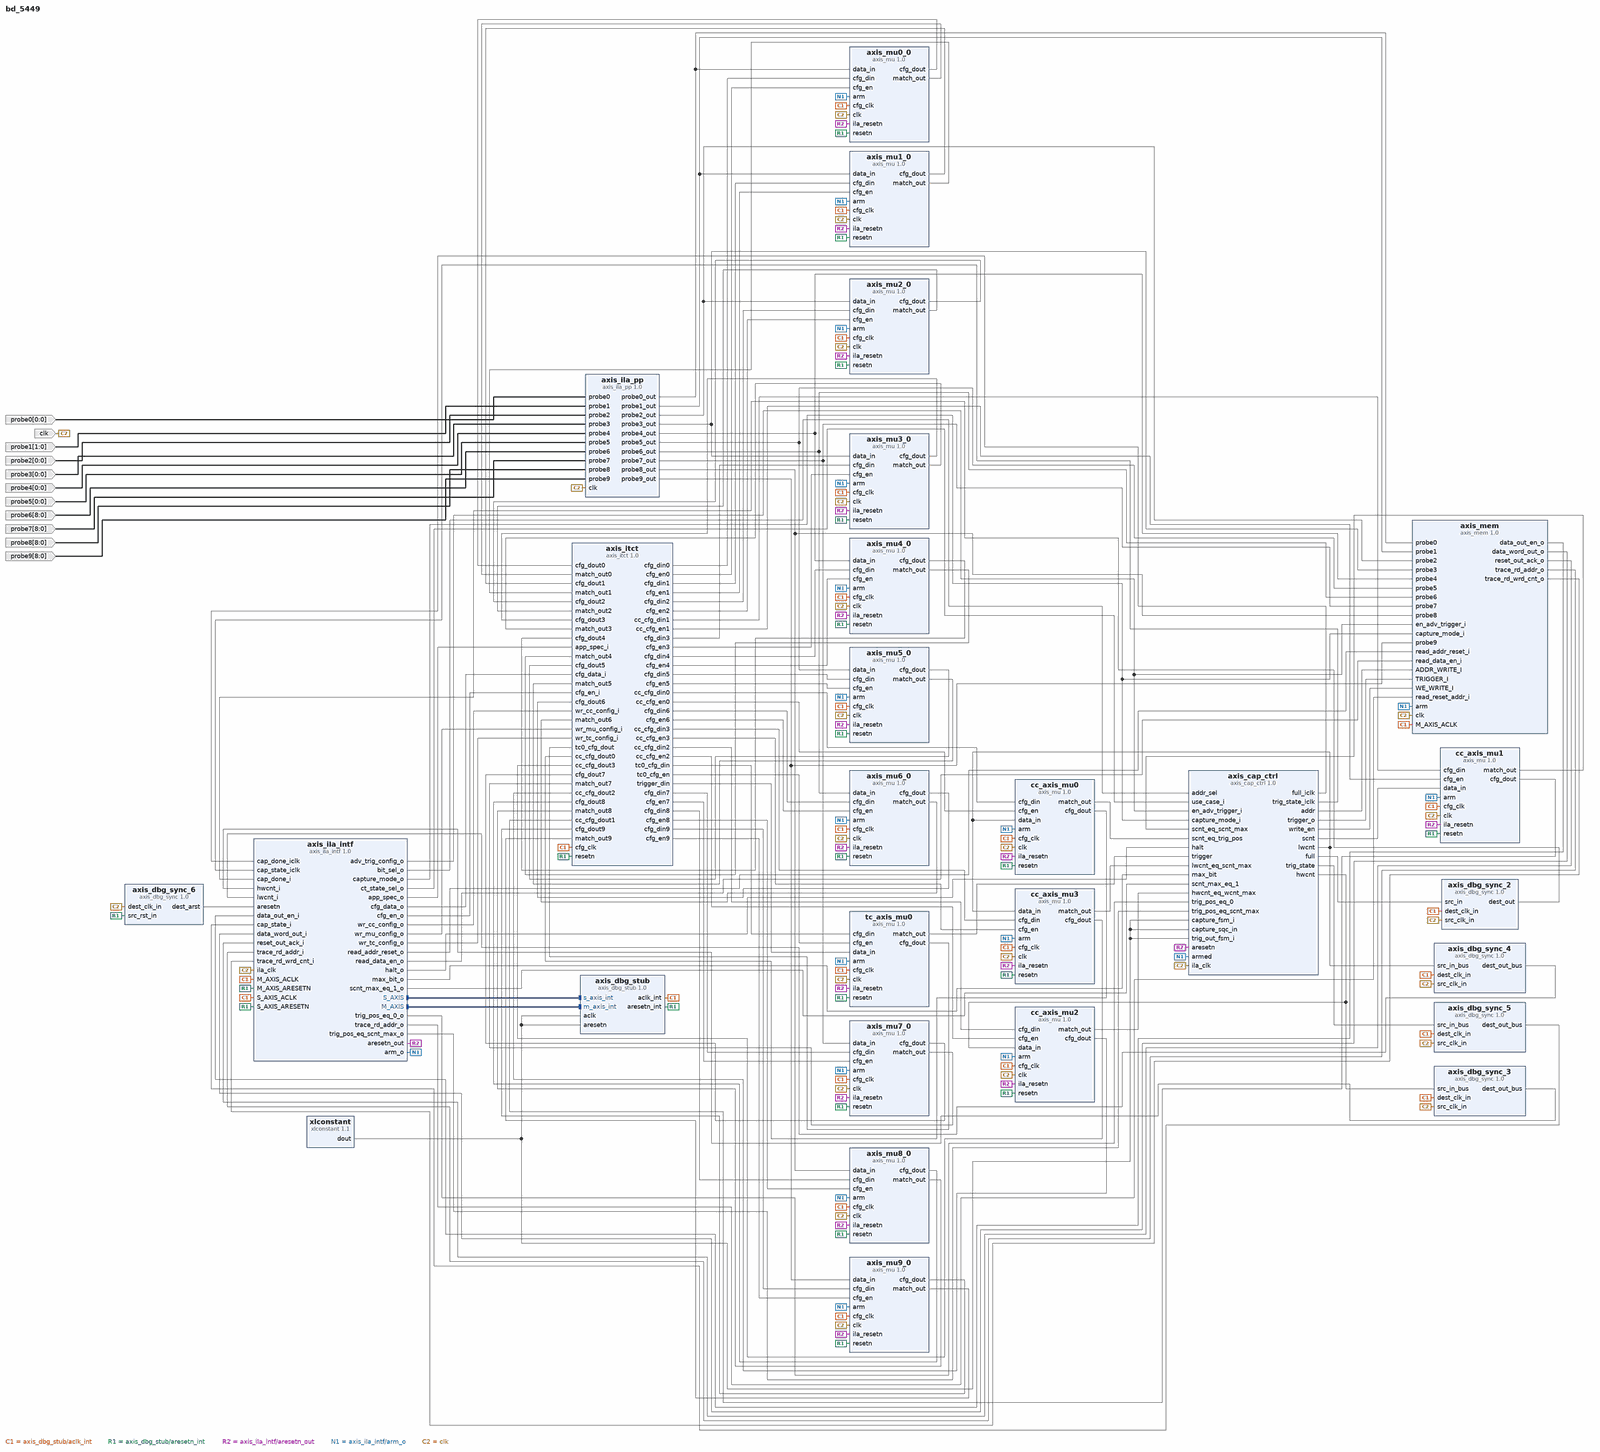
[diagram p0: block diagram of the top level, whole]
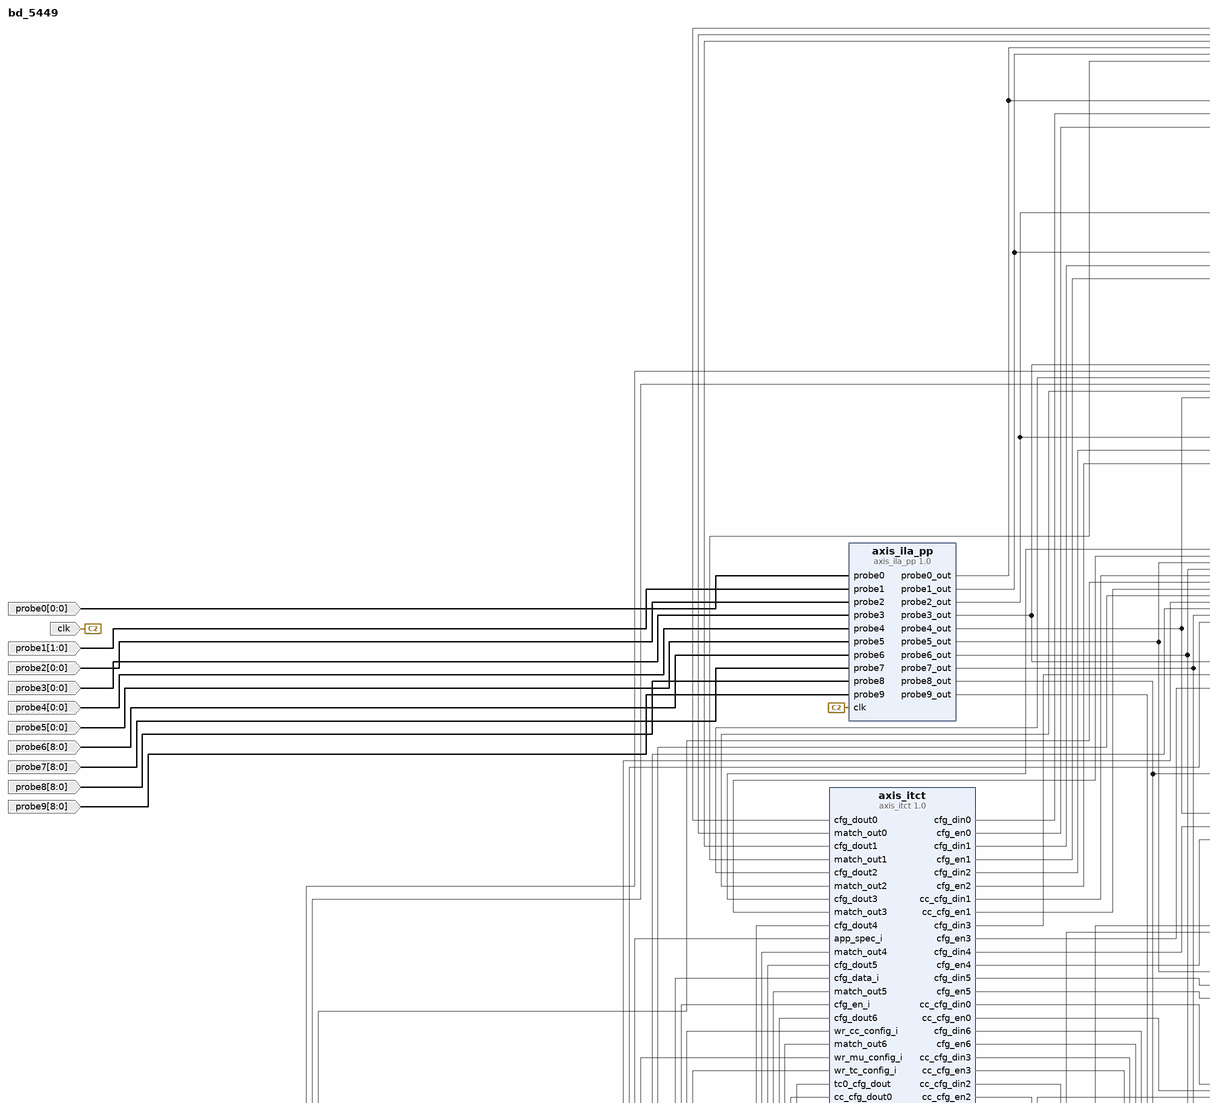
[diagram p1: block diagram of the top level, upper left part]
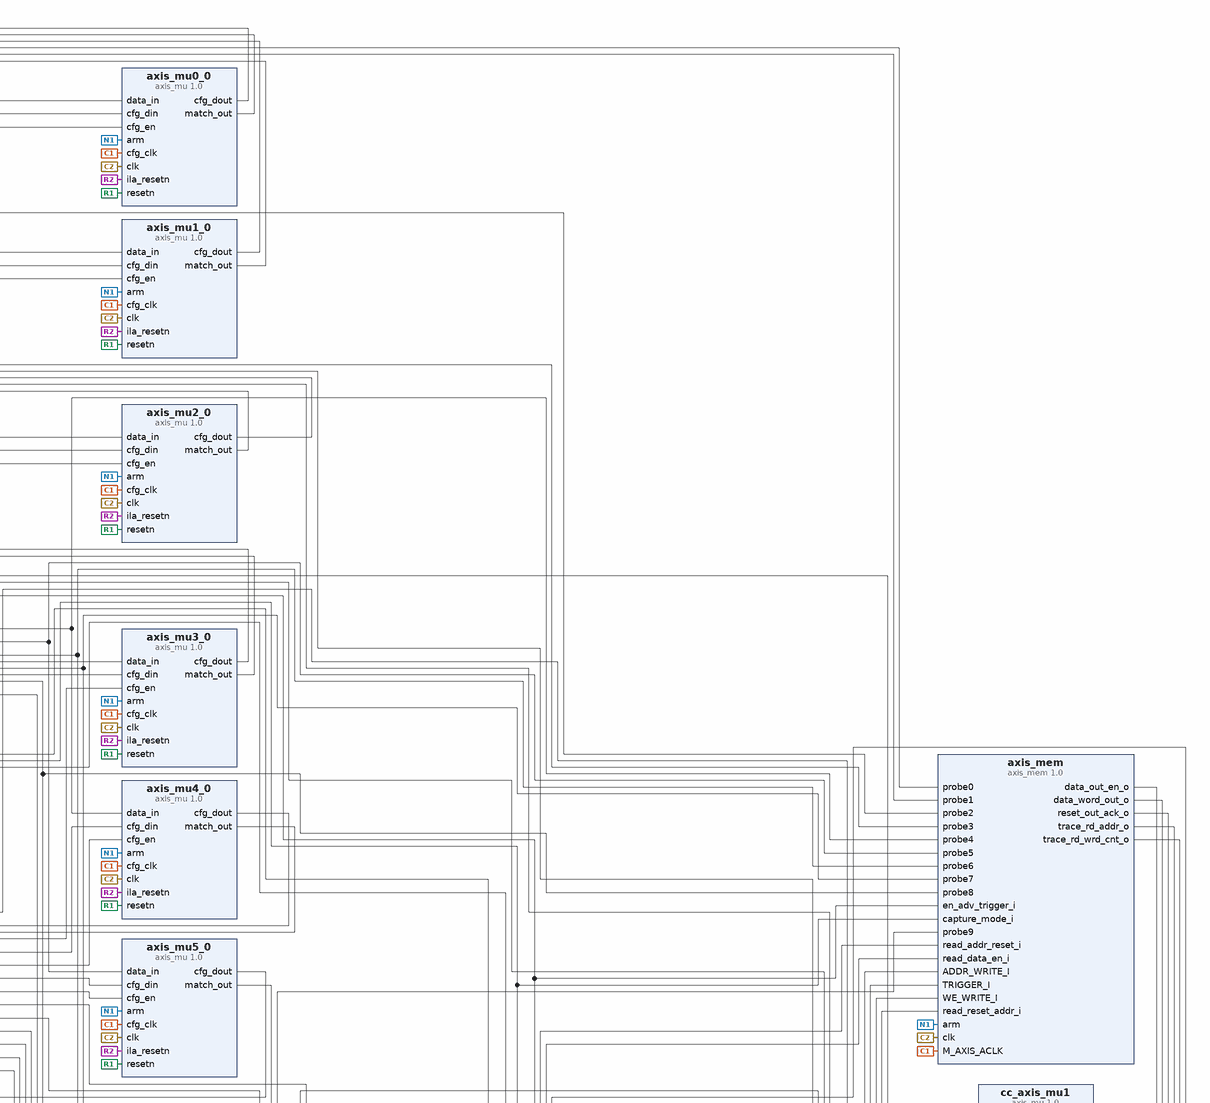
[diagram p2: block diagram of the top level, upper right part]
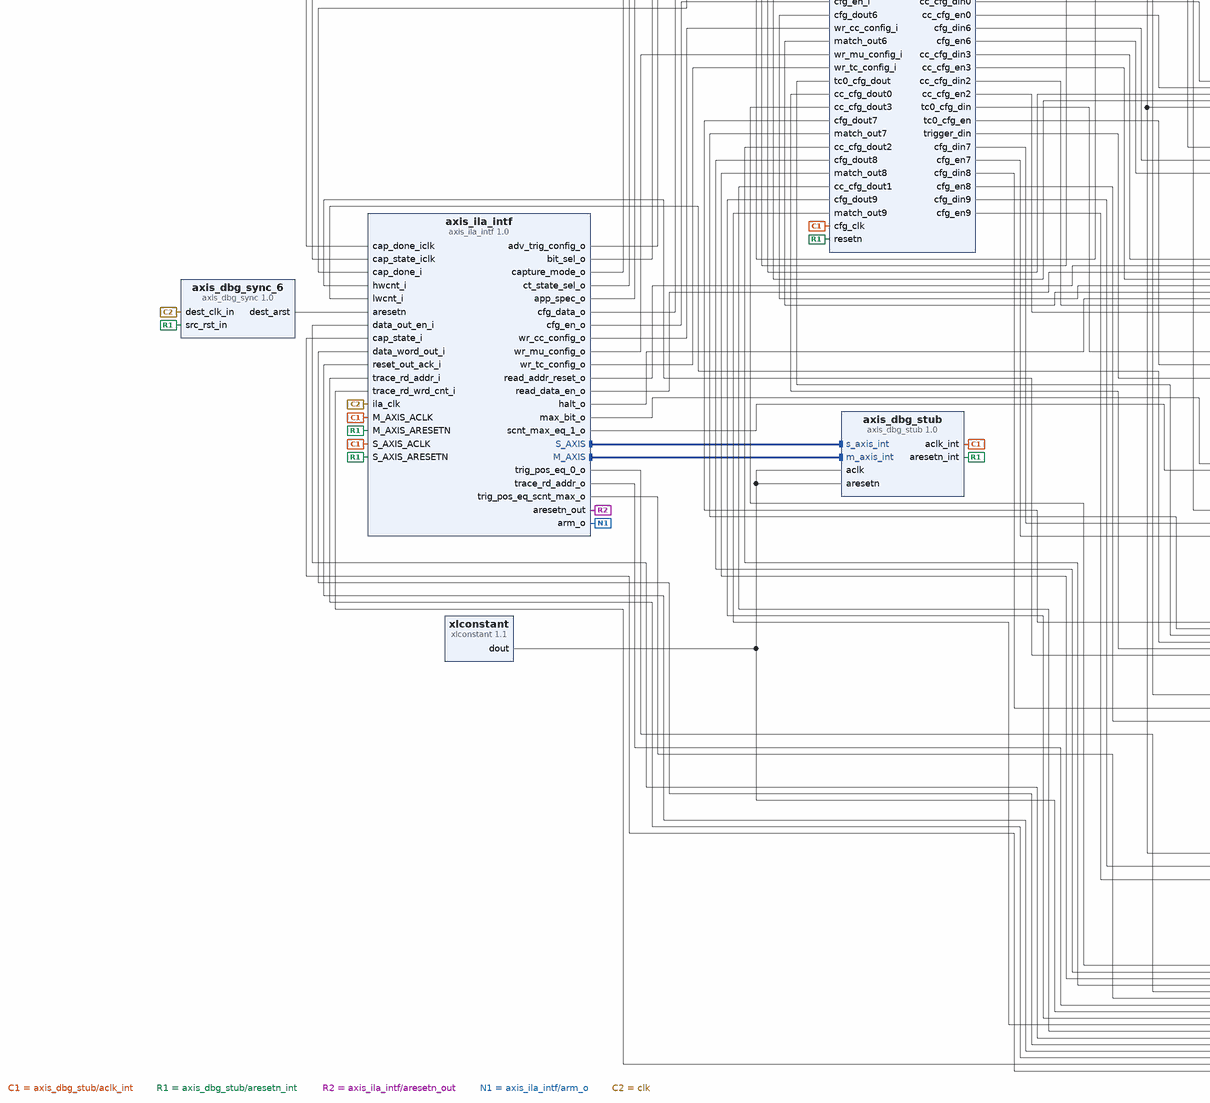
[diagram p3: block diagram of the top level, lower left part]
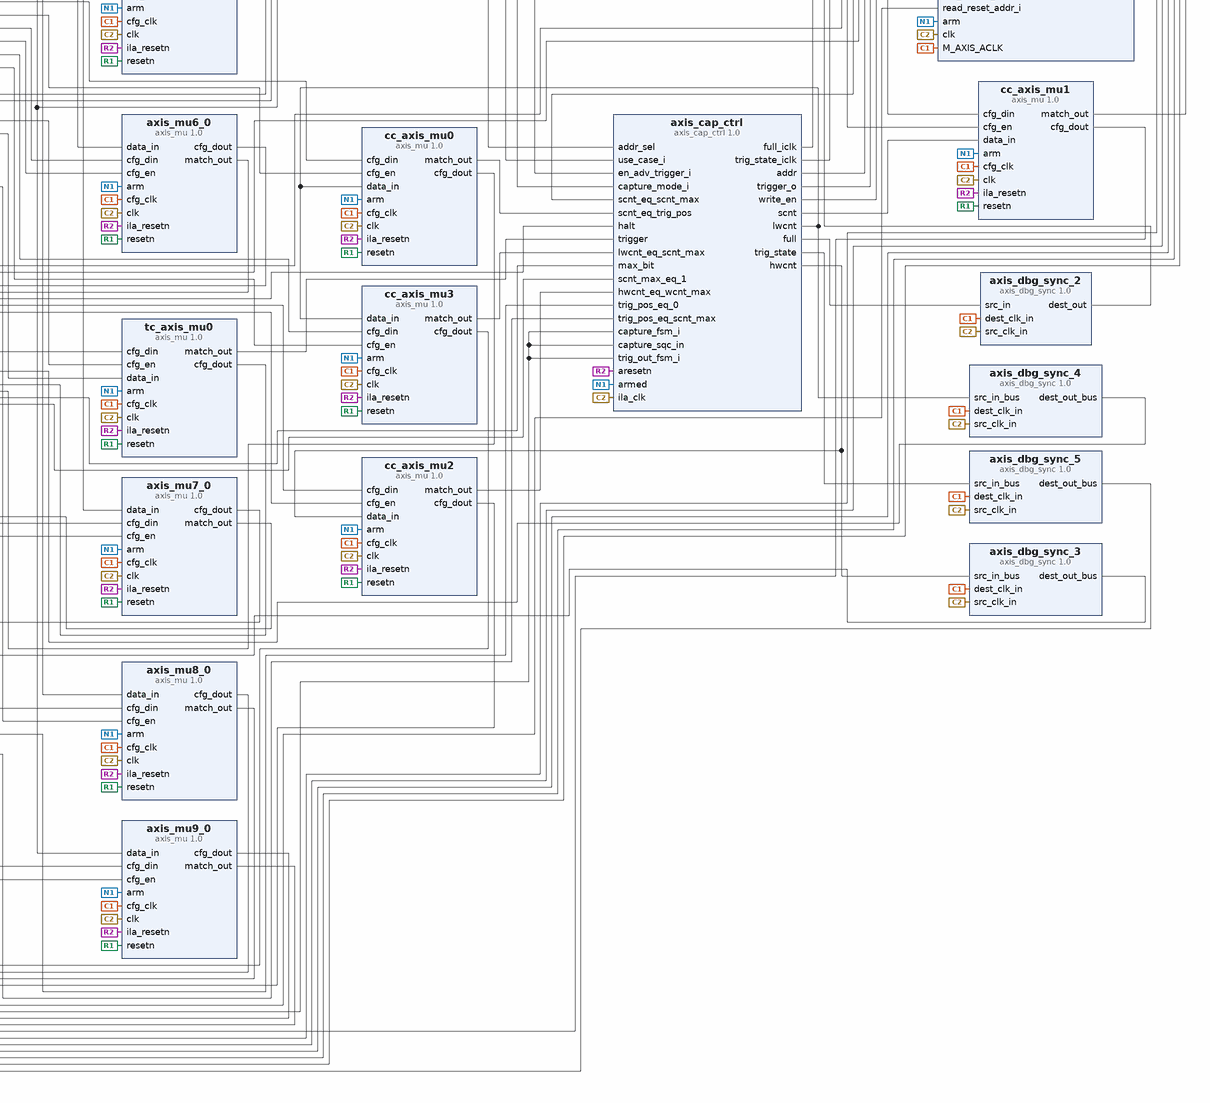
[diagram p4: block diagram of the top level, lower right part]
# Vivado block design bd_5449, xcvp1202-vsva2785-2MP-e-S, Vivado 2024.2
create_bd_design bd_5449

create_bd_port -dir I -type clk clk
create_bd_port -dir I -from 0 -to 0 -type data probe0
create_bd_port -dir I -from 1 -to 0 -type data probe1
create_bd_port -dir I -from 0 -to 0 -type data probe2
create_bd_port -dir I -from 0 -to 0 -type data probe3
create_bd_port -dir I -from 0 -to 0 -type data probe4
create_bd_port -dir I -from 0 -to 0 -type data probe5
create_bd_port -dir I -from 8 -to 0 -type data probe6
create_bd_port -dir I -from 8 -to 0 -type data probe7
create_bd_port -dir I -from 8 -to 0 -type data probe8
create_bd_port -dir I -from 8 -to 0 -type data probe9

create_bd_cell -type ip -vlnv xilinx.com:ip:axis_dbg_stub:1.0 axis_dbg_stub
set_property -dict {CONFIG.C_AXIS_DATA_WIDTH 32} [get_bd_cells axis_dbg_stub]
create_bd_cell -type ip -vlnv xilinx.com:ip:xlconstant:1.1 xlconstant
set_property -dict {CONFIG.CONST_VAL 0} [get_bd_cells xlconstant]
create_bd_cell -type ip -vlnv xilinx.com:ip:axis_ila_intf:1.0 axis_ila_intf
